# Altium schematic sheet DAC_USB.SchDoc
size A4; Organization: Altium Limited; Address1: L3, 12a Rodborough Rd; Address2: Frenchs Forest; Address3: NSW; Address4: Australia 2086
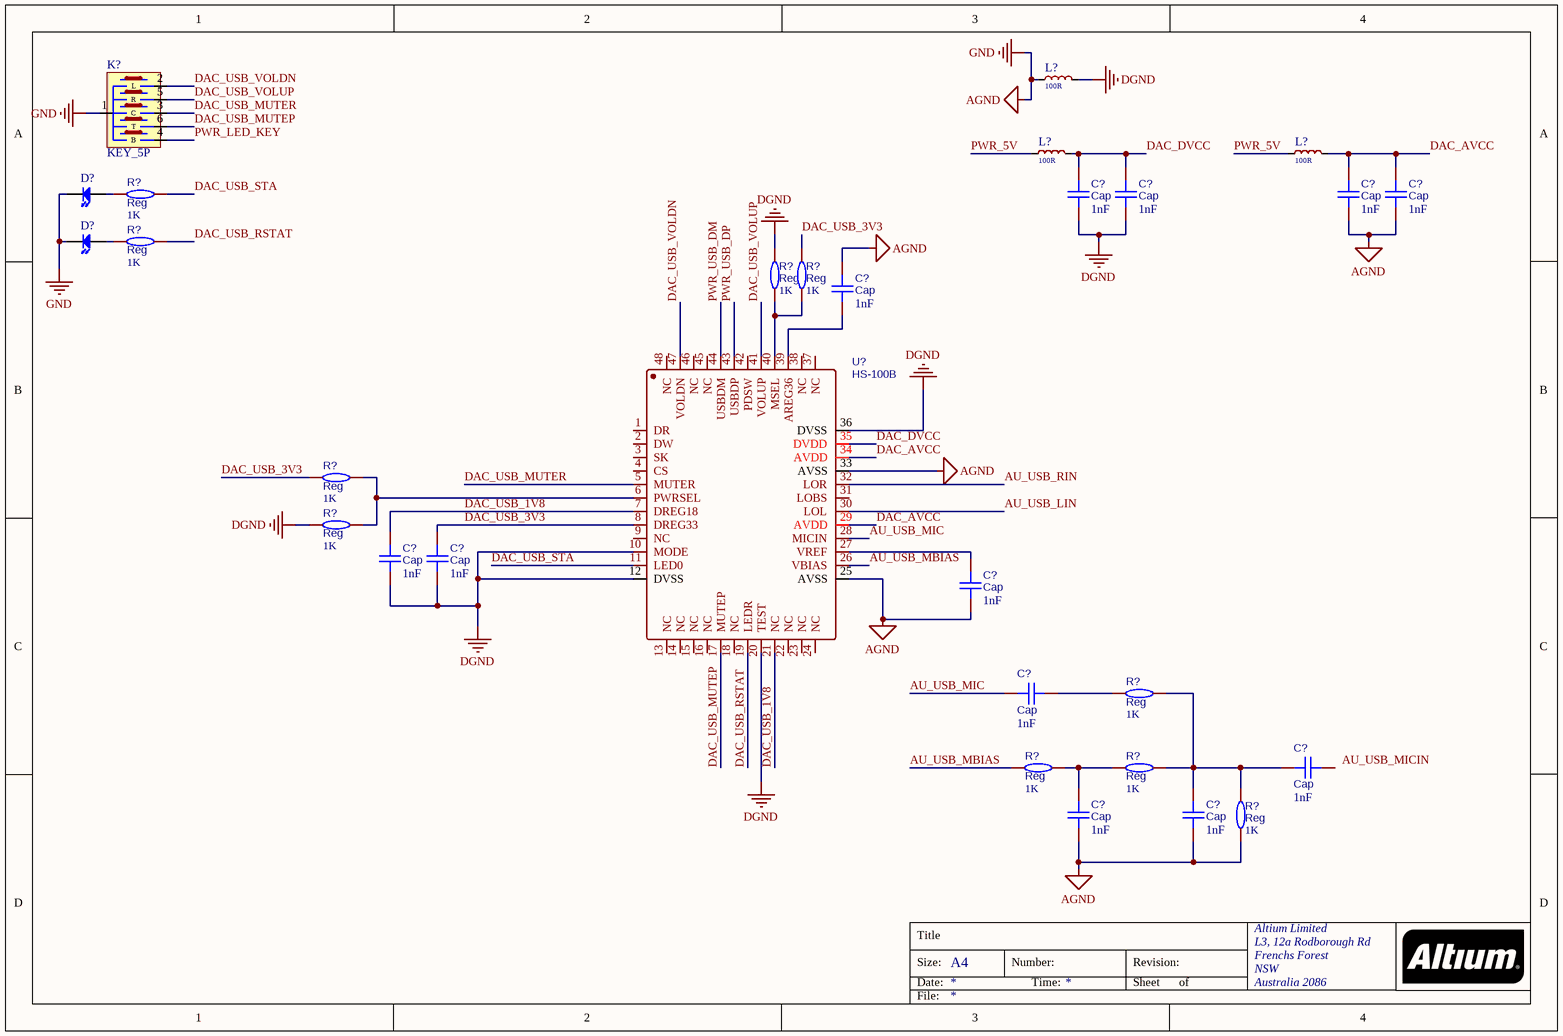
[diagram p0: DAC_USB.SchDoc]

## Parts
(Parts that share a designator on the sheet are numbered #1, #2 ... from top to bottom, then left to right.)
C?#1  Cap  value 1nF  [C0603]
C?#2  Cap  value 1nF  [C0603]
C?#3  Cap  value 1nF  [C0603]
C?#4  Cap  value 1nF  [C0603]
C?#5  Cap  value 1nF  [C0603]
C?#6  Cap  value 1nF  [C0603]
C?#7  Cap  value 1nF  [C0603]
C?#8  Cap  value 1nF  [C0603]
C?#9  Cap  value 1nF  [C0603]
C?#10  Cap  value 1nF  [C0603]
C?#11  Cap  value 1nF  [C0603]
C?#12  Cap  value 1nF  [C0603]
D?#1  LED  [LED0603]  (value not drawn)
D?#2  LED  [LED0603]  (value not drawn)
K?  KEY_5P  [KEY_5]
L?#1  value 100R  [L0603]  (hidden comment: 电感磁珠)
L?#2  value 100R  [L0603]  (hidden comment: 电感磁珠)
L?#3  value 100R  [L0603]  (hidden comment: 电感磁珠)
R?#1  Reg  value 1K  [R0603]
R?#2  Reg  value 1K  [R0603]
R?#3  Reg  value 1K  [R0603]
R?#4  Reg  value 1K  [R0603]
R?#5  Reg  value 1K  [R0603]
R?#6  Reg  value 1K  [R0603]
R?#7  Reg  value 1K  [R0603]
R?#8  Reg  value 1K  [R0603]
R?#9  Reg  value 1K  [R0603]
R?#10  Reg  value 1K  [R0603]
U?  HS-100B  [LQFP-48_L7.0-W7.0-P0.50-LS9.0-BL]

## Nets
AGND: C?#3.2 C?#4.2 C?#5.1 C?#8.2 C?#11.2 C?#12.2 D?#1.1(K) D?#2.1(K) K?.1(G) L?#1.1 R?#10.1 U?.25(AVSS) U?.33(AVSS)  [also labelled GND]
DGND: C?#1.2 C?#2.2 C?#6.2 C?#7.2 L?#1.2 R?#3.2 R?#6.2 U?.10(MODE) U?.12(DVSS) U?.20(TEST) U?.36(DVSS)
AU_USB_LIN: U?.30(LOL)
AU_USB_MBIAS: R?#8.1 U?.26(VBIAS)
AU_USB_MIC: C?#9.1 U?.28(MICIN)
AU_USB_RIN: U?.32(LOR)
DAC_AVCC: C?#3.1 C?#4.1 L?#3.2 U?.29(AVDD) U?.34(AVDD)
DAC_DVCC: C?#1.1 C?#2.1 L?#2.2 U?.35(DVDD)
DAC_USB_1V8: C?#6.1 U?.7(DREG18) U?.21(NC)
DAC_USB_3V3: C?#7.1 R?#4.2 R?#5.2 U?.8(DREG33)
DAC_USB_MUTEP: K?.6(T) U?.17(MUTEP)
DAC_USB_MUTER: K?.3(C) U?.5(MUTER)
DAC_USB_RSTAT: R?#2.1 U?.19(LEDR)
DAC_USB_STA: R?#1.1 U?.11(LED0)
DAC_USB_VOLDN: K?.2(L) U?.47(VOLDN)
DAC_USB_VOLUP: K?.5(R) U?.41(VOLUP)
PWR_5V: L?#2.1 L?#3.1
PWR_LED_KEY: K?.4(B)
PWR_USB_DM: U?.44(USBDM)
PWR_USB_DP: U?.43(USBDP)
NetC?#5_2: C?#5.2 U?.39(AREG36)
NetC?#8_1: C?#8.1 U?.27(VREF)
NetC?#9_2: C?#9.2 R?#7.1
NetC?#10_1: C?#10.1 C?#12.1 R?#7.2 R?#9.2 R?#10.2
NetC?#11_1: C?#11.1 R?#8.2 R?#9.1
NetD?#1_2: D?#1.2(A) R?#1.2
NetD?#2_2: D?#2.2(A) R?#2.2
NetR?#3_1: R?#3.1 R?#4.1 U?.40(MSEL)
NetR?#5_1: R?#5.1 R?#6.1 U?.6(PWRSEL)

Not connected (* = marked no-connect by the designer): C?#10 2; U? 1(DR) 2(DW) 3(SK) 4(CS) 9(NC) 13(NC) 14(NC) 15(NC) 16(NC) 18(NC) 22(NC) 23(NC) 24(NC) 31(LOBS) 37(NC) 38(NC) 42(PDSW) 45(NC) 46(NC) 48(NC)

## Notes on the sheet
- Labels drawn without touching a wire or pin: AU_USB_MICIN
- Title
- Size:
- Date:
- A4
- Number:
- Time:
- Revision:
- Sheet
- of
- File:

## Library data of the parts
C?#1-C?#12 = CAP: BOM_Manufacturer: Huaxin S&T; BOM_Manufacturer Part: 0603B103K101CT; nameAlias: Capacitance; Contributor: LCSC; BOM_Supplier: LCSC; BOM_Supplier Part: C302008; spicePre: C; spiceSymbolName: 0603B103K101CT
D?#1 D?#2 = LED0: Published: 8-Jun-2000; LatestRevisionDate: 08-Jul-2005; LatestRevisionNote: Mech Layer 1 removed.; PackageReference: LED-0; Publisher: Altium Limited; PackageDescription: LED; 2 Leads
K? = KEY_5P: 五向开关
L?#1-L?#3 = IND_FB
R?#1-R?#10 = Res: 电阻; BOM_Manufacturer: Viking Tech; BOM_Manufacturer Part: AR03BTCX1002A; nameAlias: Resistance (Ohms); Contributor: LCSC; BOM_Supplier: LCSC; BOM_Supplier Part: C465721; spicePre: R; spiceSymbolName: AR03BTCX1002A
U? = HS-100B: HS-100B USB Audio; BOM_Manufacturer: Cmedia; Contributor: LCSC; BOM_Supplier: LCSC; BOM_Supplier Part: C371351; BOM_Manufacturer Part: HS-100B; BOM_JLCPCB Part Class: Extended Part; spicePre: U; spiceSymbolName: HS-100B